# EAGLE design untitled (EAGLE 6.3)
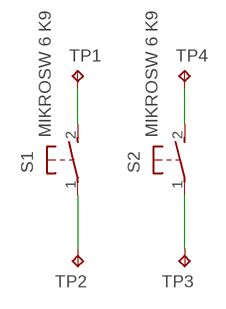
[diagram p0: schematic, sheet 1]

## Parts
S1  MIKROSW 6 K9  KAN0631-090-X-X  [MIKROSW_6_K9]
S2  MIKROSW 6 K9  KAN0631-090-X-X  [MIKROSW_6_K9]
TP1  TPPAD1-13Y  [P1-13Y]
TP2  TPPAD1-13Y  [P1-13Y]
TP3  TPPAD1-13Y  [P1-13Y]
TP4  TPPAD1-13Y  [P1-13Y]

## Nets
N$1: S1.2(S) TP1.TP
N$2: S1.1(P) TP2.TP
N$3: S2.1(P) TP3.TP
N$4: S2.2(S) TP4.TP

## Library data of the parts
S1 S2 = switch_SileliS:KAN0631-090-X-X
TP1-TP4 = testpad:TP: Test pad

## Board
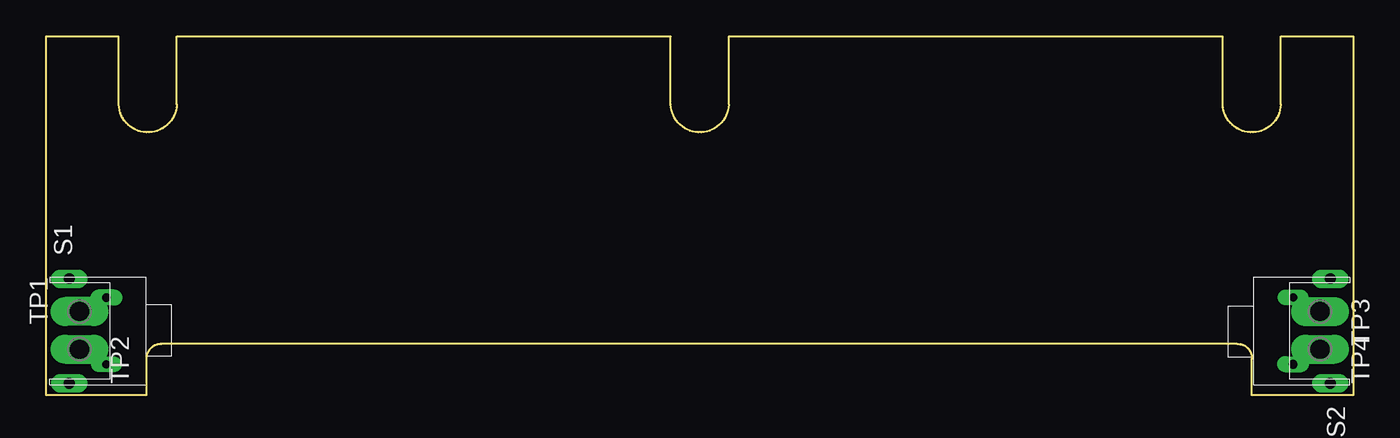
[diagram p1: board, top side]
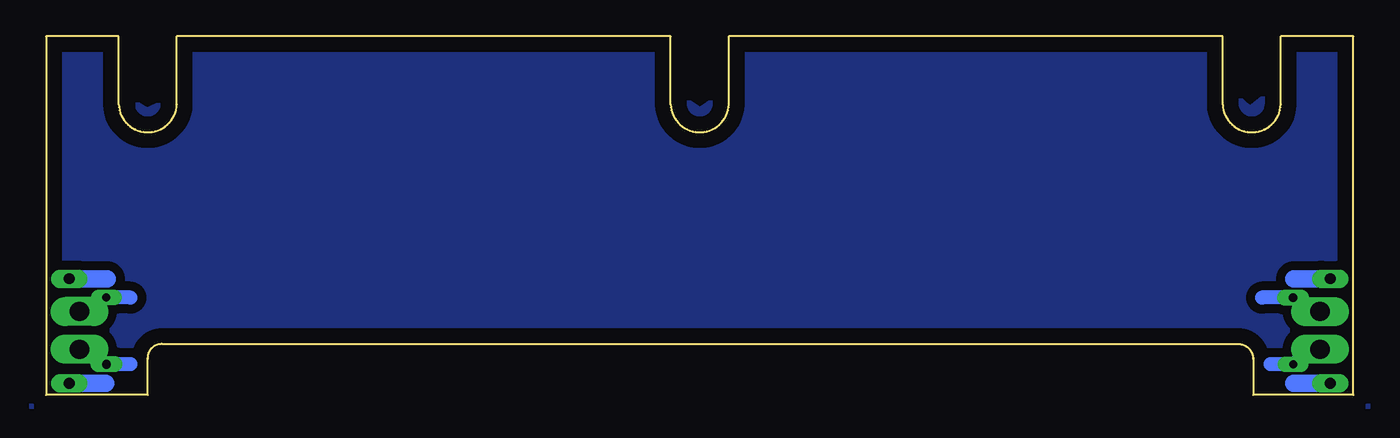
[diagram p2: board, bottom side, seen from below]

Size 90 x 24.7 mm. Coordinates in mm from the lower left corner, seen from the top.
Outline: 83,2.45 83,0 90,0 90,24.7 85,24.7 85,20 arc-175 81,20 81,24.7 47,24.7 47,20 arc-175 43,20 43,24.7 9,24.7 9,20 arc-175 5,20 5,24.7 0,24.7 0,0 6.9,0 6.9,2.45
Outline: 83,2.45 83,2.5
Outline: 7.95,3.5 82,3.5 arc-99 83,2.45
Outline: 7.95,3.5 7.9,3.5
Outline: 6.9,2.5 6.9,2.45
Outline: 7.95,3.5 arc93 6.9,2.45
Copper layers (1*16): Top 0.035mm / dielectric 1.5mm / Bottom 0.035mm
Design rules "default": minimum track width 10mil, minimum drill 24mil, track to track 8mil, track to pad 8mil, pad to pad 8mil, via to via 8mil, smd to smd 8mil, copper to edge 40mil, drill to drill 8mil, minimum pad ring 10mil, minimum via ring 8mil, stop-mask expansion 4mil, vias tented up to drill 0mil, thermal gap 10mil

### Footprints (pad centres in the part's own frame; a part is rotated, then mirrored left to right if it is on the bottom)
MIKROSW_6_K9 = drill 0.56 long: 1 -2.3,1.45 | drill 0.6 long: 2 2.3,1.45 | drill 0.75 long: P$1 -3.6,4; P$2 3.6,4
P1-13Y = drill 1.321 pad 1.905 long: TP 0,0

### Placement (x,y rotation side)
S1  5.6,4.4 90 top
S2  84.4,4.4 270 top
TP1  2.3,5.74 90 top
TP2  2.3,3.14 270 top
TP3  87.7,5.74 270 top
TP4  87.7,3.14 270 top

### Tracks (layer width: path | path; a pad name or v marks a point on that pad's centre or on a via)
N$1
  Bottom 0.406: 4.2,6.7 S1.2
  Bottom 0.97: 4.2,6.7 6.3,6.7
  Bottom 1.016: TP1.TP S1.2
N$2
  Bottom 0.406: S1.1 4.2,2.1
  Bottom 0.97: 4.2,2.1 5.7,2.1
  Bottom 1.016: TP2.TP S1.1
N$3
  Bottom 0.406: S2.1 85.7,6.7
  Bottom 0.97: 84.2,6.7 85.7,6.7
  Bottom 1.016: TP3.TP S2.1
N$4
  Bottom 0.406: 85.7,2.1 S2.2
  Bottom 0.97: 84.2,2.1 85.7,2.1
  Bottom 1.016: TP4.TP S2.2
N$7
  Bottom 1.21: 1.7,8 4.1,8
N$8
  Bottom 1.21: 1.7,0.8 4.1,0.8
N$9
  Bottom 1.21: 85.9,0.8 88.3,0.8
N$71
  Bottom 1.21: 85.8,8 88.4,8
STRUCTURAL_REINFORCEMENT
  pour Bottom (isolate 0.61): -1,-0.8 -1,25.2 6.1,25.2 6.1,20.5 7.1,19.7 7.2,19.8 8,20.5 8,25.2 44,25.2 44,20.3 45,19.6 46,20.3 46,25.2 82,25.2 82,20.1 83,19.6 83.1,19.6 83.9,20.1 83.9,25.2 91,25.2 91,-0.8 82.3,-0.8 82.3,2.9 7.5,2.9 7.5,-0.8